# Altium schematic sheet ADC_DAC_SW_BT.SchDoc
size A4
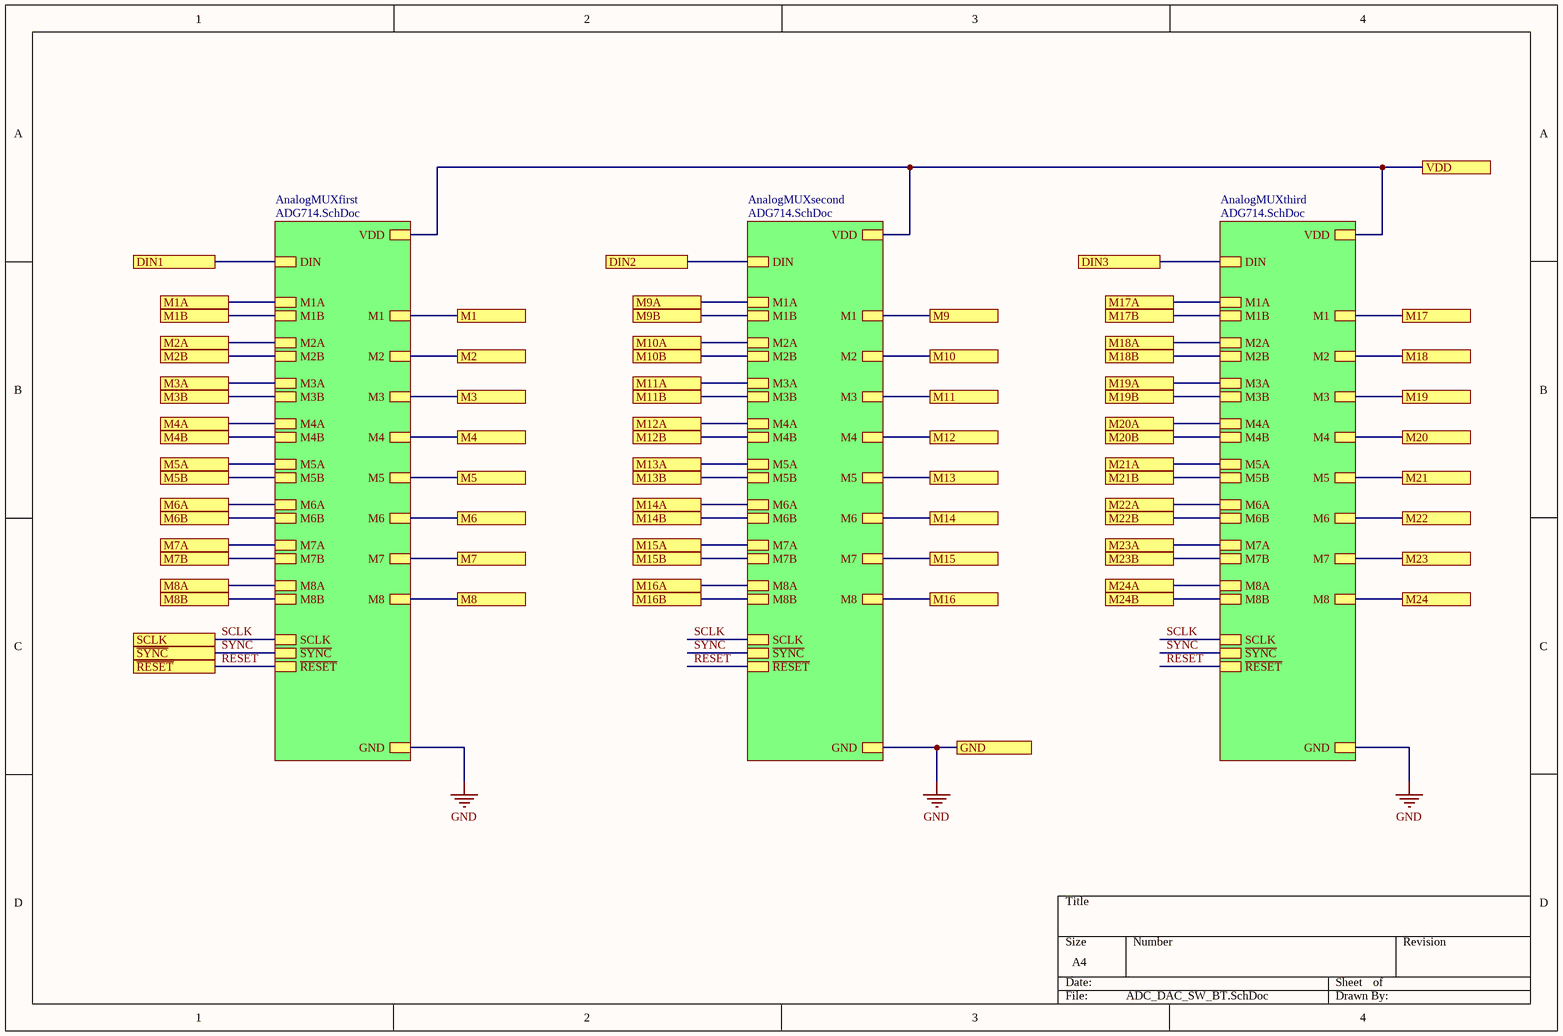
[diagram p0: ADC_DAC_SW_BT.SchDoc]

## Sub-sheets
AnalogMUXfirst = ADG714.SchDoc: GND, M2, M3B, M1, M2B, M2A, M4B, M4, M5A, M6B, M7A, M7B, M8A, M8B, M5, M6, M7, M8, M6A, M5B, M3A, M4A, M3, M1B, M1A, SCLK, VDD, ~{SYNC}, ~{RESET}, DIN
AnalogMUXsecond = ADG714.SchDoc: GND, M2, M3B, M1, M2B, M2A, M4B, M4, M5A, M6B, M7A, M7B, M8A, M8B, M5, M6, M7, M8, M6A, M5B, M3A, M4A, M3, M1B, M1A, SCLK, VDD, ~{SYNC}, ~{RESET}, DIN
AnalogMUXthird = ADG714.SchDoc: GND, M2, M3B, M1, M2B, M2A, M4B, M4, M5A, M6B, M7A, M7B, M8A, M8B, M5, M6, M7, M8, M6A, M5B, M3A, M4A, M3, M1B, M1A, SCLK, VDD, ~{SYNC}, ~{RESET}, DIN

## Ports
DIN1, DIN2, DIN3, GND, M1, M1A, M1B, M2, M2A, M2B, M3, M3A, M3B, M4, M4A, M4B, M5, M5A, M5B, M6, M6A, M6B, M7, M7A, M7B, M8, M8A, M8B, M9, M9A, M9B, M10, M10A, M10B, M11, M11A, M11B, M12, M12A, M12B, M13, M13A, M13B, M14, M14A, M14B, M15, M15A, M15B, M16, M16A, M16B, M17, M17A, M17B, M18, M18A, M18B, M19, M19A, M19B, M20, M20A, M20B, M21, M21A, M21B, M22, M22A, M22B, M23, M23A, M23B, M24, M24A, M24B, SCLK, VDD, ~{RESET}, ~{SYNC}

## Nets
GND: port GND, sheet AnalogMUXfirst/GND, sheet AnalogMUXsecond/GND, sheet AnalogMUXthird/GND
DIN1: port DIN1, sheet AnalogMUXfirst/DIN
DIN2: port DIN2, sheet AnalogMUXsecond/DIN
DIN3: port DIN3, sheet AnalogMUXthird/DIN
M1: port M1, sheet AnalogMUXfirst/M1
M1A: port M1A, sheet AnalogMUXfirst/M1A
M1B: port M1B, sheet AnalogMUXfirst/M1B
M2: port M2, sheet AnalogMUXfirst/M2
M2A: port M2A, sheet AnalogMUXfirst/M2A
M2B: port M2B, sheet AnalogMUXfirst/M2B
M3: port M3, sheet AnalogMUXfirst/M3
M3A: port M3A, sheet AnalogMUXfirst/M3A
M3B: port M3B, sheet AnalogMUXfirst/M3B
M4: port M4, sheet AnalogMUXfirst/M4
M4A: port M4A, sheet AnalogMUXfirst/M4A
M4B: port M4B, sheet AnalogMUXfirst/M4B
M5: port M5, sheet AnalogMUXfirst/M5
M5A: port M5A, sheet AnalogMUXfirst/M5A
M5B: port M5B, sheet AnalogMUXfirst/M5B
M6: port M6, sheet AnalogMUXfirst/M6
M6A: port M6A, sheet AnalogMUXfirst/M6A
M6B: port M6B, sheet AnalogMUXfirst/M6B
M7: port M7, sheet AnalogMUXfirst/M7
M7A: port M7A, sheet AnalogMUXfirst/M7A
M7B: port M7B, sheet AnalogMUXfirst/M7B
M8: port M8, sheet AnalogMUXfirst/M8
M8A: port M8A, sheet AnalogMUXfirst/M8A
M8B: port M8B, sheet AnalogMUXfirst/M8B
M9: port M9, sheet AnalogMUXsecond/M1
M9A: port M9A, sheet AnalogMUXsecond/M1A
M9B: port M9B, sheet AnalogMUXsecond/M1B
M10: port M10, sheet AnalogMUXsecond/M2
M10A: port M10A, sheet AnalogMUXsecond/M2A
M10B: port M10B, sheet AnalogMUXsecond/M2B
M11: port M11, sheet AnalogMUXsecond/M3
M11A: port M11A, sheet AnalogMUXsecond/M3A
M11B: port M11B, sheet AnalogMUXsecond/M3B
M12: port M12, sheet AnalogMUXsecond/M4
M12A: port M12A, sheet AnalogMUXsecond/M4A
M12B: port M12B, sheet AnalogMUXsecond/M4B
M13: port M13, sheet AnalogMUXsecond/M5
M13A: port M13A, sheet AnalogMUXsecond/M5A
M13B: port M13B, sheet AnalogMUXsecond/M5B
M14: port M14, sheet AnalogMUXsecond/M6
M14A: port M14A, sheet AnalogMUXsecond/M6A
M14B: port M14B, sheet AnalogMUXsecond/M6B
M15: port M15, sheet AnalogMUXsecond/M7
M15A: port M15A, sheet AnalogMUXsecond/M7A
M15B: port M15B, sheet AnalogMUXsecond/M7B
M16: port M16, sheet AnalogMUXsecond/M8
M16A: port M16A, sheet AnalogMUXsecond/M8A
M16B: port M16B, sheet AnalogMUXsecond/M8B
M17: port M17, sheet AnalogMUXthird/M1
M17A: port M17A, sheet AnalogMUXthird/M1A
M17B: port M17B, sheet AnalogMUXthird/M1B
M18: port M18, sheet AnalogMUXthird/M2
M18A: port M18A, sheet AnalogMUXthird/M2A
M18B: port M18B, sheet AnalogMUXthird/M2B
M19: port M19, sheet AnalogMUXthird/M3
M19A: port M19A, sheet AnalogMUXthird/M3A
M19B: port M19B, sheet AnalogMUXthird/M3B
M20: port M20, sheet AnalogMUXthird/M4
M20A: port M20A, sheet AnalogMUXthird/M4A
M20B: port M20B, sheet AnalogMUXthird/M4B
M21: port M21, sheet AnalogMUXthird/M5
M21A: port M21A, sheet AnalogMUXthird/M5A
M21B: port M21B, sheet AnalogMUXthird/M5B
M22: port M22, sheet AnalogMUXthird/M6
M22A: port M22A, sheet AnalogMUXthird/M6A
M22B: port M22B, sheet AnalogMUXthird/M6B
M23: port M23, sheet AnalogMUXthird/M7
M23A: port M23A, sheet AnalogMUXthird/M7A
M23B: port M23B, sheet AnalogMUXthird/M7B
M24: port M24, sheet AnalogMUXthird/M8
M24A: port M24A, sheet AnalogMUXthird/M8A
M24B: port M24B, sheet AnalogMUXthird/M8B
~{RESET}: port ~{RESET}, sheet AnalogMUXfirst/~{RESET}, sheet AnalogMUXsecond/~{RESET}, sheet AnalogMUXthird/~{RESET}
~{SYNC}: port ~{SYNC}, sheet AnalogMUXfirst/~{SYNC}, sheet AnalogMUXsecond/~{SYNC}, sheet AnalogMUXthird/~{SYNC}
SCLK: port SCLK, sheet AnalogMUXfirst/SCLK, sheet AnalogMUXsecond/SCLK, sheet AnalogMUXthird/SCLK
VDD: port VDD, sheet AnalogMUXfirst/VDD, sheet AnalogMUXsecond/VDD, sheet AnalogMUXthird/VDD